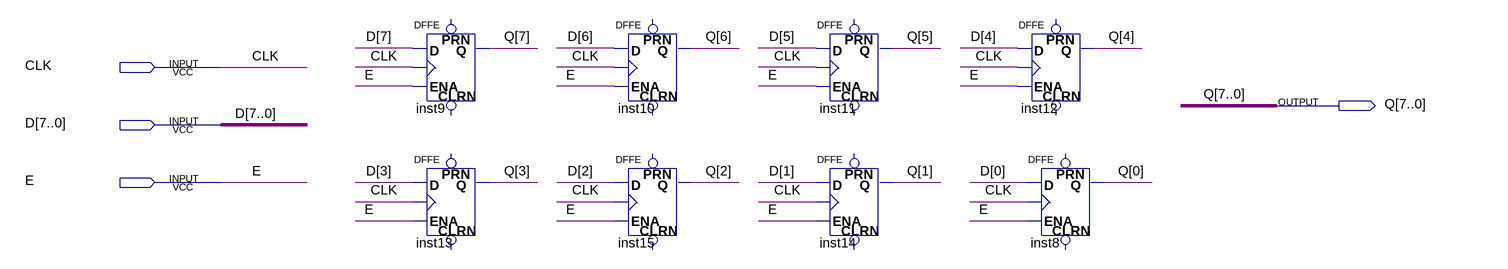
[diagram p0: schematic sheet]
// Quartus schematic REGISTER.bdf as structural Verilog: 8 symbols, 4 pins
module REGISTER (
  input  CLK,
  input  [7:0] D,
  input  E,
  output [7:0] Q
);

  DFFE inst9 (.D(D[7]), .CLK(CLK), .ENA(E), .Q(Q[7]));  // open: PRN, CLRN
  DFFE inst13 (.D(D[3]), .CLK(CLK), .ENA(E), .Q(Q[3]));  // open: PRN, CLRN
  DFFE inst10 (.D(D[6]), .CLK(CLK), .ENA(E), .Q(Q[6]));  // open: PRN, CLRN
  DFFE inst15 (.D(D[2]), .CLK(CLK), .ENA(E), .Q(Q[2]));  // open: PRN, CLRN
  DFFE inst11 (.D(D[5]), .CLK(CLK), .ENA(E), .Q(Q[5]));  // open: PRN, CLRN
  DFFE inst14 (.D(D[1]), .CLK(CLK), .ENA(E), .Q(Q[1]));  // open: PRN, CLRN
  DFFE inst12 (.D(D[4]), .CLK(CLK), .ENA(E), .Q(Q[4]));  // open: PRN, CLRN
  DFFE inst8 (.D(D[0]), .CLK(CLK), .ENA(E), .Q(Q[0]));  // open: PRN, CLRN
endmodule
